# Altium schematic sheet POWER.SCHDOC
size A4
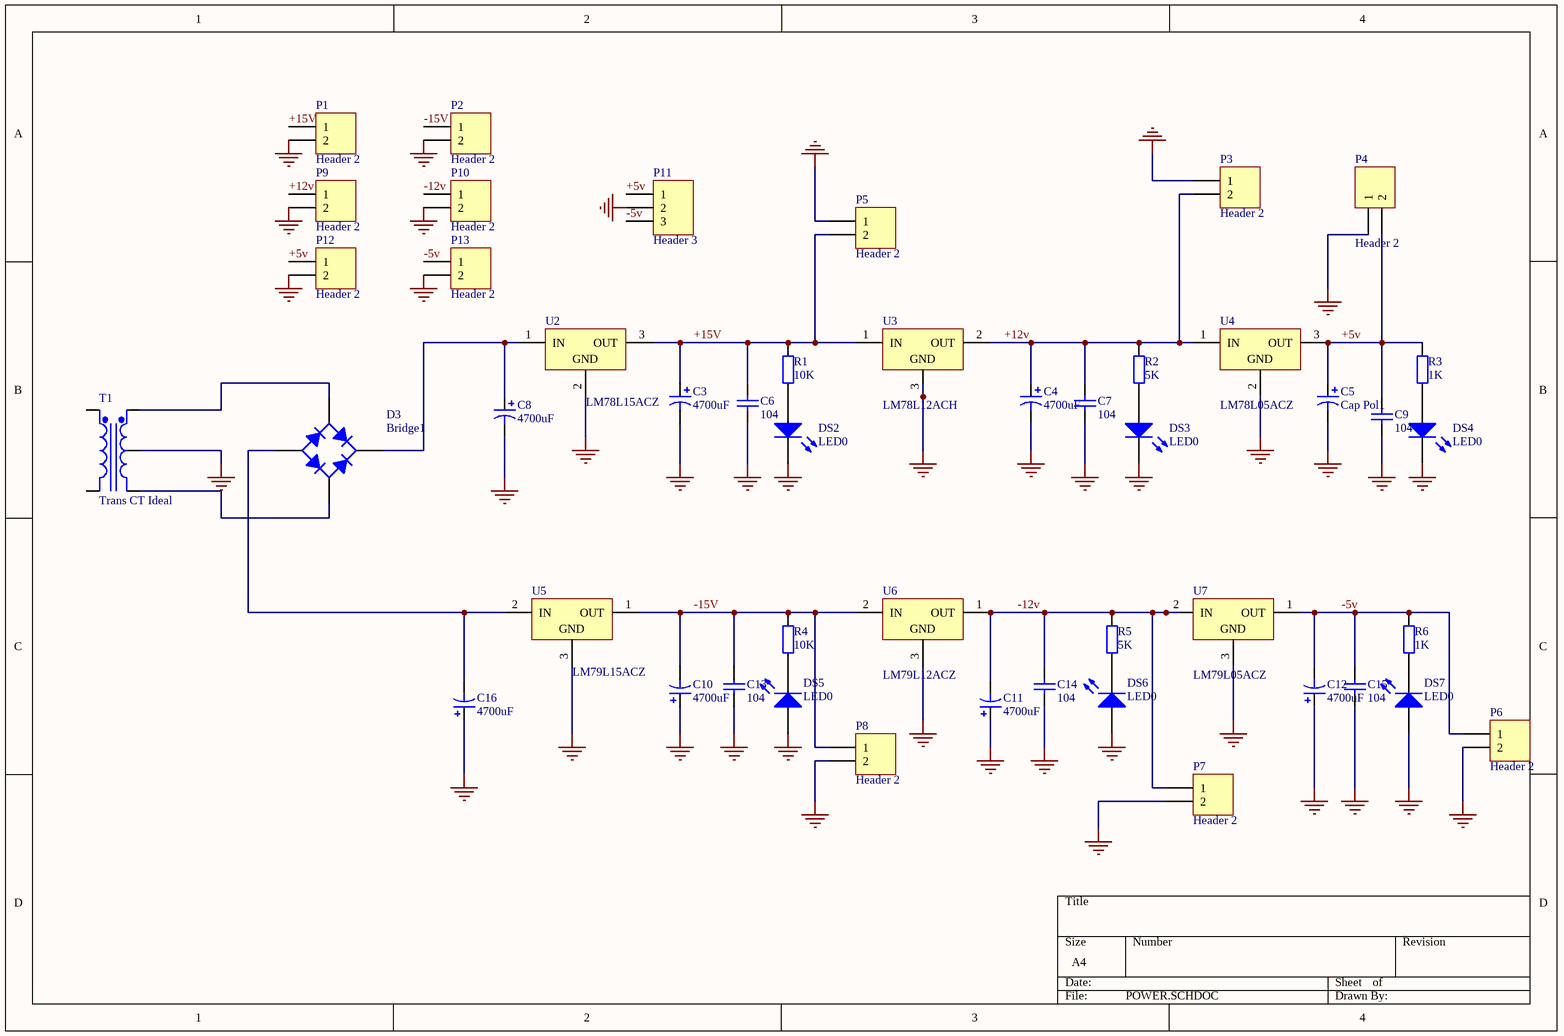
[diagram p0: POWER.SCHDOC]

## Parts
C3  4700uF  [RB7.6-15]
C4  4700uF  [RB7.6-15]
C5  Cap Pol1  [RB7.6-15]
C6  104  [CAPR5.08-7.8x3.2]
C7  104  [CAPR5.08-7.8x3.2]
C8  4700uF  [RB7.6-15]
C9  104  [CAPR5.08-7.8x3.2]
C10  4700uF  [RB7.6-15]
C11  4700uF  [RB7.6-15]
C12  4700uF  [RB7.6-15]
C13  104  [CAPR5.08-7.8x3.2]
C14  104  [CAPR5.08-7.8x3.2]
C15  104  [CAPR5.08-7.8x3.2]
C16  4700uF  [RB7.6-15]
D3  Bridge1  [E-BIP-P4/D10]
DS2  LED0  [PIN2]
DS3  LED0  [PIN2]
DS4  LED0  [PIN2]
DS5  LED0  [PIN2]
DS6  LED0  [PIN2]
DS7  LED0  [PIN2]
P1  Header 2  [HDR1X2]
P2  Header 2  [HDR1X2]
P3  Header 2  [HDR1X2]
P4  Header 2  [HDR1X2]
P5  Header 2  [HDR1X2]
P6  Header 2  [HDR1X2]
P7  Header 2  [HDR1X2]
P8  Header 2  [HDR1X2]
P9  Header 2  [HDR1X2]
P10  Header 2  [HDR1X2]
P11  Header 3  [HDR1X3]
P12  Header 2  [HDR1X2]
P13  Header 2  [HDR1X2]
R1  10K  [AXIAL-0.4]
R2  5K  [AXIAL-0.4]
R3  1K  [AXIAL-0.4]
R4  10K  [AXIAL-0.4]
R5  5K  [AXIAL-0.4]
R6  1K  [AXIAL-0.4]
T1  Trans CT Ideal  [TRF_5]
U2  LM78L15ACZ  [T03B]
U3  LM78L12ACH  [T03B]
U4  LM78L05ACZ  [T03B]
U5  LM79L15ACZ  [T03B]
U6  LM79L12ACZ  [T03B]
U7  LM79L05ACZ  [T03B]

## Nets
GND: C3.2 C4.2 C5.2 C6.1 C7.1 C8.2 C9.1 C10.1 C11.1 C12.1 C13.1 C14.1 C15.1 C16.1 DS2.2(K) DS3.2(K) DS4.2(K) DS5.1(A) DS6.1(A) DS7.1(A) P1.2 P2.2 P3.1 P4.1 P5.1 P6.2 P7.2 P8.2 P9.2 P10.2 P11.2 P12.2 P13.2 T1.4(SecCT) U2.2(GND) U3.3(GND) U4.2(GND) U5.3(GND) U6.3(GND) U7.3(GND)
+5v: C5.1 C9.2 P4.2 P11.1 P12.1 R3.2 U4.3(OUT)
+12v: C4.1 C7.2 P3.2 P9.1 R2.2 U3.2(OUT) U4.1(IN)
+15V: C3.1 C6.2 P1.1 P5.2 R1.2 U2.3(OUT) U3.1(IN)
-5v: C12.2 C15.2 P6.1 P11.3 P13.1 R6.2 U7.1(OUT)
-12v: C11.2 C14.2 P7.1 P10.1 R5.2 U6.1(OUT) U7.2(IN)
-15V: C10.2 C13.2 P2.1 P8.1 R4.2 U5.1(OUT) U6.2(IN)
NetC8_1: C8.1 D3.3(K) U2.1(IN)
NetC16_2: C16.2 D3.1(A) U5.2(IN)
NetD3_2: D3.2(C) T1.3(Sec+)
NetD3_4: D3.4(C) T1.5(Sec-)
NetDS2_1: DS2.1(A) R1.1
NetDS3_1: DS3.1(A) R2.1
NetDS4_1: DS4.1(A) R3.1
NetDS5_2: DS5.2(K) R4.1
NetDS6_2: DS6.2(K) R5.1
NetDS7_2: DS7.2(K) R6.1

Not connected (* = marked no-connect by the designer): T1 1(Pri+) 2(Pri-)

## Library data of the parts
C3-C5 C8 C10-C12 C16 = Cap Pol1: Polarized Capacitor (Radial); Published: 8-Jun-2000; LatestRevisionDate: 17-Jul-2002; LatestRevisionNote: Re-released for DXP Platform.; Publisher: Altium Limited
C6 C7 C9 C13-C15 = Cap: Capacitor; Published: 8-Jun-2000; LatestRevisionDate: 17-Jul-2002; LatestRevisionNote: Re-released for DXP Platform.; Publisher: Altium Limited
D3 = Bridge1: Full Wave Diode Bridge; Published: 8-Jun-2000; LatestRevisionDate: 17-Jul-2002; LatestRevisionNote: Re-released for DXP Platform.; Publisher: Altium Limited
DS2-DS7 = LED0: Typical INFRARED GaAs LED; Published: 8-Jun-2000; LatestRevisionDate: 17-Jul-2002; LatestRevisionNote: Re-released for DXP Platform.; Publisher: Altium Limited
P1-P10 P12 P13 = Header 2: Header, 2-Pin; LatestRevisionDate: 17-Jul-2002; LatestRevisionNote: Re-released for DXP Platform.; Publisher: Altium Limited
P11 = Header 3: Header, 3-Pin; LatestRevisionDate: 17-Jul-2002; LatestRevisionNote: Re-released for DXP Platform.; Publisher: Altium Limited
R1-R6 = Res2: Resistor; Published: 8-Jun-2000; LatestRevisionDate: 17-Jul-2002; LatestRevisionNote: Re-released for DXP Platform.; Publisher: Altium Limited
T1 = Trans CT Ideal: Center-Tapped Transformer (Ideal); Published: 8-Jun-2000; LatestRevisionDate: 17-Jul-2002; LatestRevisionNote: Re-released for DXP Platform.; Publisher: Altium Limited
U2 = LM78L15ACZ: 3-Terminal Positive Regulator; PackageDocument: 2000; Published: 15-Apr-2002; DatasheetDocument: Sep-1999; PackageReference: Z03A; Publisher: Altium Limited; ComponentLink1Description: Manufacturer Link; ComponentLink1URL: http://www.national.com/
U3 = LM78L12ACH: 3-Terminal Positive Regulator; PackageDocument: 2000; Note: Case is connected to GND; Published: 15-Apr-2002; DatasheetDocument: Jan-1995; PackageReference: H03A; Publisher: Altium Limited; ComponentLink1Description: Manufacturer Link; ComponentLink1URL: http://www.national.com/
U4 = LM78L05ACZ: 3-Terminal Positive Regulator; PackageDocument: 2000; Published: 15-Apr-2002; DatasheetDocument: Sep-1999; PackageReference: Z03A; Publisher: Altium Limited; ComponentLink1Description: Manufacturer Link; ComponentLink1URL: http://www.national.com/
U5 = LM79L15ACZ: 3-Terminal Negative Regulator; PackageDocument: 2000; Published: 15-Apr-2002; DatasheetDocument: Jul-1999; PackageReference: Z03A; Publisher: Altium Limited; ComponentLink1Description: Manufacturer Link; ComponentLink1URL: http://www.national.com/
U6 = LM79L12ACZ: 3-Terminal Negative Regulator; PackageDocument: 2000; Published: 15-Apr-2002; DatasheetDocument: Jul-1999; PackageReference: Z03A; Publisher: Altium Limited; ComponentLink1Description: Manufacturer Link; ComponentLink1URL: http://www.national.com/
U7 = LM79L05ACZ: 3-Terminal Negative Regulator; PackageDocument: 2000; Published: 15-Apr-2002; DatasheetDocument: Jul-1999; PackageReference: Z03A; Publisher: Altium Limited; ComponentLink1Description: Manufacturer Link; ComponentLink1URL: http://www.national.com/